# Altium schematic sheet Sensor Bar 2.0 sensors.SchDoc
size A4
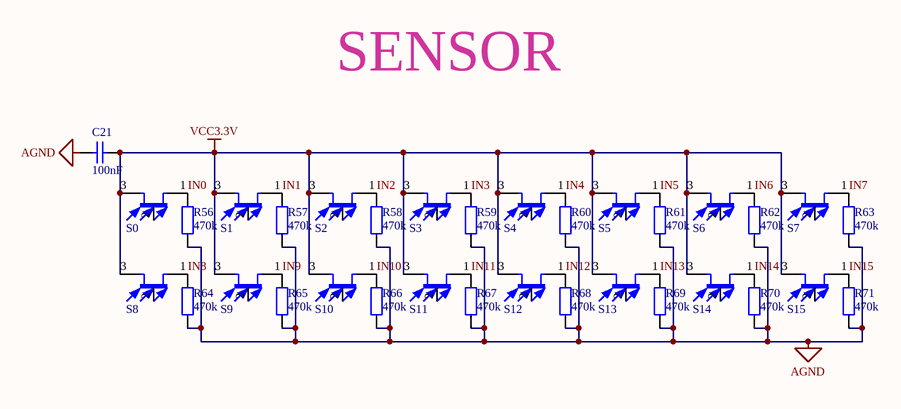
[diagram p0: Sensor Bar 2.0 sensors.SchDoc]

## Parts
C21  100nF  [CC2012-0805]
R56  470k  [CR2012-0805]
R57  470k  [CR2012-0805]
R58  470k  [CR2012-0805]
R59  470k  [CR2012-0805]
R60  470k  [CR2012-0805]
R61  470k  [CR2012-0805]
R62  470k  [CR2012-0805]
R63  470k  [CR2012-0805]
R64  470k  [CR2012-0805]
R65  470k  [CR2012-0805]
R66  470k  [CR2012-0805]
R67  470k  [CR2012-0805]
R68  470k  [CR2012-0805]
R69  470k  [CR2012-0805]
R70  470k  [CR2012-0805]
R71  470k  [CR2012-0805]
S0  3du5c  [CAN-3/D5.9]  (value not drawn)
S1  3du5c  [CAN-3/D5.9]  (value not drawn)
S2  3du5c  [CAN-3/D5.9]  (value not drawn)
S3  3du5c  [CAN-3/D5.9]  (value not drawn)
S4  3du5c  [CAN-3/D5.9]  (value not drawn)
S5  3du5c  [CAN-3/D5.9]  (value not drawn)
S6  3du5c  [CAN-3/D5.9]  (value not drawn)
S7  3du5c  [CAN-3/D5.9]  (value not drawn)
S8  3du5c  [CAN-3/D5.9]  (value not drawn)
S9  3du5c  [CAN-3/D5.9]  (value not drawn)
S10  3du5c  [CAN-3/D5.9]  (value not drawn)
S11  3du5c  [CAN-3/D5.9]  (value not drawn)
S12  3du5c  [CAN-3/D5.9]  (value not drawn)
S13  3du5c  [CAN-3/D5.9]  (value not drawn)
S14  3du5c  [CAN-3/D5.9]  (value not drawn)
S15  3du5c  [CAN-3/D5.9]  (value not drawn)

## Nets
AGND: C21.2 R56.1 R57.1 R58.1 R59.1 R60.1 R61.1 R62.1 R63.1 R64.1 R65.1 R66.1 R67.1 R68.1 R69.1 R70.1 R71.1
VCC3.3V: C21.1 S0.3 S1.3 S2.3 S3.3 S4.3 S5.3 S6.3 S7.3 S8.3 S9.3 S10.3 S11.3 S12.3 S13.3 S14.3 S15.3
IN0: R56.2 S0.1
IN1: R57.2 S1.1
IN2: R58.2 S2.1
IN3: R59.2 S3.1
IN4: R60.2 S4.1
IN5: R61.2 S5.1
IN6: R62.2 S6.1
IN7: R63.2 S7.1
IN8: R64.2 S8.1
IN9: R65.2 S9.1
IN10: R66.2 S10.1
IN11: R67.2 S11.1
IN12: R68.2 S12.1
IN13: R69.2 S13.1
IN14: R70.2 S14.1
IN15: R71.2 S15.1

Not connected (* = marked no-connect by the designer): S0 2; S1 2; S2 2; S3 2; S4 2; S5 2; S6 2; S7 2; S8 2; S9 2; S10 2; S11 2; S12 2; S13 2; S14 2; S15 2

## Notes on the sheet
- SENSOR

## Library data of the parts
C21 = Cap Semi: Capacitor (Semiconductor SIM Model); Published: 8-Jun-2000; LatestRevisionDate: 17-Jul-2002; LatestRevisionNote: Re-released for DXP Platform.; PackageReference: C1206; Publisher: Altium Limited
R56-R71 = Res2: Resistor; Published: 8-Jun-2000; Revision: July-2002: Re-released for DXP Platform.; Publisher: Altium Limited; Value: 470k
S0-S15 = Light